# Altium schematic sheet PWR.SchDoc
size A; Organization: Altium Limited; Address1: L3, 12a Rodborough Rd; Address2: Frenchs Forest; Address3: NSW; Address4: Australia 2086
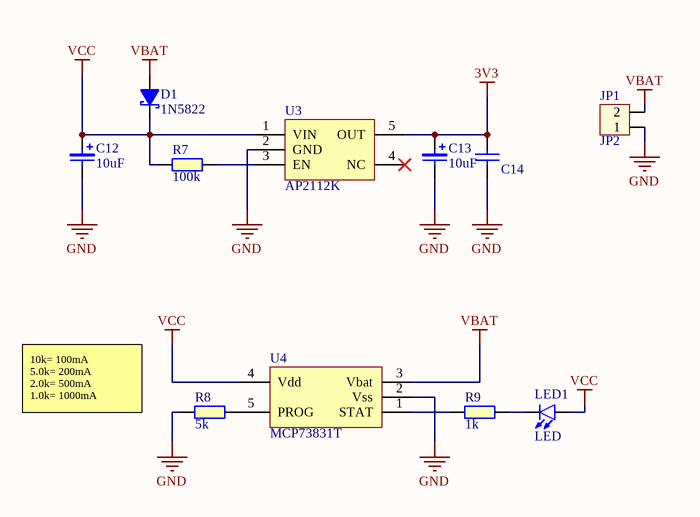
[diagram p0: PWR.SchDoc]

## Parts
C12  10uF  [CASE A]
C13  10uF  [CASE A]
C14  0.01uF  [C_0603]  (value not drawn)
D1  1N5822  [DO-214AC]
JP1  JP2  [CON2]
LED1  LED  [LED_0603]
R7  100k  [R_0603]
R8  5k  [R_0603]
R9  1k  [R_0603]
U3  AP2112K  [SOT25]
U4  MCP73831T  [SOT23-5]

## Nets
3V3: C13.A C14.2 U3.5(OUT)
GND: C12.K C13.K C14.1 JP1.1 R8.2 U3.2(GND) U4.2(Vss)
VBAT: D1.A JP1.2 U4.3(Vbat)
VCC: C12.A D1.K LED1.A R7.2 U3.1(VIN) U4.4(Vdd)
NetLED1_K: LED1.K R9.1
NetR7_1: R7.1 U3.3(EN)
NetR8_1: R8.1 U4.5(PROG)
NetR9_2: R9.2 U4.1(STAT)

Not connected (* = marked no-connect by the designer): U3 4(NC)*

## Notes on the sheet
- (near R8) 10k= 100mA
  5.0k= 200mA
  2.0k= 500mA
  1.0k= 1000mA
- Title
- Size:
- Date:
- A
- Number:
- Time:
- Revision:
- Sheet
- of
- File:

## Library data of the parts
C12 C13 = Capacitor-Tantalium: CAP TANT 10UF 16V 10% 2917; Part Number: T491A106K010AT; Part Description: CAP TANT 10UF 10V 10% 1206; Manufacturer: KEMET; ID: 3; Voltage: 10VDC; Tolerance: 20%; Component Kind: Standard; Component Type: Standard; Pin Count: 2; Status: Not Recommended; Manufacturer Part Number: T491A106K010AT; Case: A CASE; Mounted: Yes; Socket: No; SMD: Yes; ComponentHeigh: https://www.mouser.vn; Manufacturer1 Example: MDBK; Value: 10uF
C14 = CAP_0603
D1 = DIODE_1N5822: 3A 40V SS34
JP1 = Con2: Connector 2; Value: Connector 2
LED1 = LED_0603
R7-R9 = RES_0603
U3 = AP2112K: IC REG LINEAR 3.3V 600MA SOT25; Manufacturer: Diodes; Manufacturer Part Number: AP2112K-3.3TRG1; Min Input Voltage: 2.5V; Number of Outputs: 1; Dropout Voltage: 250mV; Max Input Voltage: 6V; Quiescent Current: 55uA; Polarity: Positive; Accuracy: 1.5%; Output Type: Fixed; Supplier 1: Mouser; Stock 1: 34833; Pricing 1: 1=0.47, 10=0.327, 50=0.327, 100=0.15, 1000=0.116, 10000=0.09 (USD); Mount: Surface Mount; Case/Package: SOT-23-5; Number of Pins: 5; Min Operating Temperature: -40°C; Max Operating Temperature: 85°C; Package Quantity: 1; Packaging: Tape and Reel; Output Voltage: 3.3V; Output Current: 600mA; Number of Regulators: 1; Max Output Current: 600mA; Length: 3.1mm; Height: 1.3mm; Width: 1.7mm; Lead Free: Lead Free; ComponentLink1URL: http://www.diodes.com/datasheets/AP2112.pdf?src-supplier=Avnet; ComponentLink1Description: http://www.diodes.com/datasheets/AP2112.pdf?src-supplier=Avnet; ComponentLink2URL: https://www.diodes.com/assets/Datasheets/AP2112.pdf?src-supplier=Digi-Key; ComponentLink2Description: https://www.diodes.com/assets/Datasheets/AP2112.pdf?src-supplier=Digi-Key; Supplier Part Number 1: 621-AP2112K-3.3TRG1
U4 = MCP73831T: IC CONTROLLR LI-ION 4.2V SOT23-5; Manufacturer: Microchip; Manufacturer Part Number: MCP73831T-2ACI/OT; Number of Cells: 1; Max Supply Voltage: 6V; Min Supply Voltage: 3.75V; Output Current: 500mA; Max Output Voltage: 4.5V; Min Output Voltage: 4.168V; Max Power Dissipation: 1.54W; Drain to Source Resistance: 350mR; Voltage Rating: 4.534V; Supplier 1: Digi-Key; Stock 1: 50323; Pricing 1: 1=0.58, 25=0.484, 100=0.4326 (USD); Mount: Surface Mount; Case/Package: SOT-23; Number of Pins: 5; Weight: 0.00709oz; Contact Plating: Tin,Matte; Min Operating Temperature: -40°C; Max Operating Temperature: 85°C; Output Voltage: 4.2V; Packaging: Tape and Reel; Max Charge Current: 500mA; Max Input Voltage: 6V; Number of Outputs: 1; Number of Channels: 1; Termination: SMD/SMT; Length: 0.122inch; Height: 0.051inch; Width: 0.071inch; Radiation Hardening: No; REACH SVHC: No SVHC; Lead Free: Lead Free; ComponentLink1URL: http://www.microchip.com/mymicrochip/filehandler.aspx?ddocname=en023833&src-supplier=Digi-Key; ComponentLink1Description: http://www.microchip.com/mymicrochip/filehandler.aspx?ddocname=en023833&src-supplier=Digi-Key; ComponentLink2URL: http://www.farnell.com/datasheets/630369.pdf?src-supplier=Element14; ComponentLink2Description: http://www.farnell.com/datasheets/630369.pdf?src-supplier=Element14; ComponentLink3URL: http://www.farnell.com/datasheets/2124927.pdf?src-supplier=Element14; ComponentLink3Description: http://www.farnell.com/datasheets/2124927.pdf?src-supplier=Element14; ComponentLink4URL: http://ww1.microchip.com/downloads/en/DeviceDoc/21984e.pdf?src-supplier=Avnet; ComponentLink4Description: http://ww1.microchip.com/downloads/en/DeviceDoc/21984e.pdf?src-supplier=Avnet; ComponentLink5URL: http://www.farnell.com/datasheets/2124927.pdf?src-supplier=Newark; ComponentLink5Description: http://www.farnell.com/datasheets/2124927.pdf?src-supplier=Newark; ComponentLink6URL: http://www.microchip.com/mymicrochip/filehandler.aspx?ddocname=en025112&src-supplier=Future+Electronics; ComponentLink6Description: http://www.microchip.com/mymicrochip/filehandler.aspx?ddocname=en025112&src-supplier=Future+Electronics; ComponentLink7URL: http://www.produktinfo.conrad.com/datenblaetter/650000-674999/651521-da-01-en-CONTR__MCP73831T_2ACI_OT_SOT_23_5_MCP.pdf?src-supplier=Conrad; ComponentLink7Description: http://www.produktinfo.conrad.com/datenblaetter/650000-674999/651521-da-01-en-CONTR__MCP73831T_2ACI_OT_SOT_23_5_MCP.pdf?src-supplier=Conrad; Supplier Part Number 1: MCP73831T-2ACI/OTDKR-ND